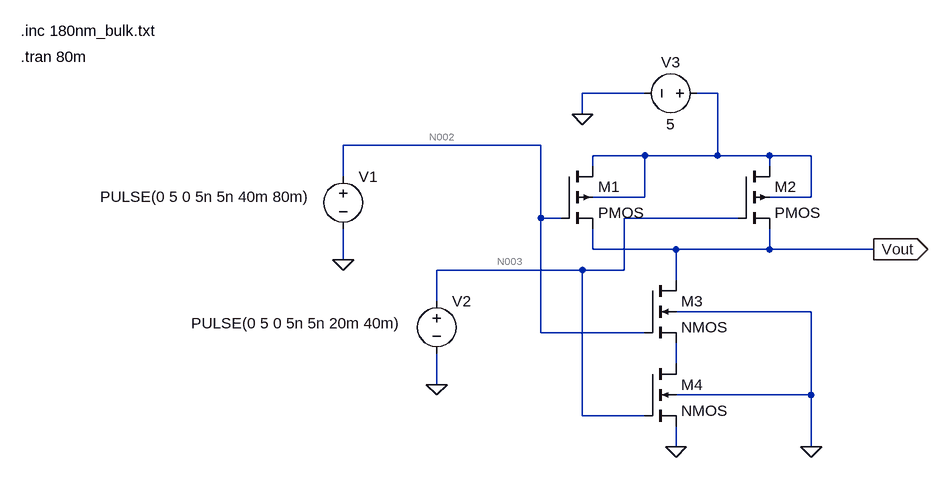
[diagram p0: schematic NAND_Gate2.asc]
NAND_Gate2.asc, the LTspice schematic file:
Version 4
SHEET 1 912 680
WIRE 448 0 352 0
WIRE 560 0 528 0
WIRE 352 32 352 0
WIRE 288 80 -16 80
WIRE 448 96 368 96
WIRE 560 96 560 0
WIRE 560 96 448 96
WIRE 640 96 560 96
WIRE 704 96 640 96
WIRE 368 112 368 96
WIRE 640 112 640 96
WIRE -16 128 -16 80
WIRE 448 160 448 96
WIRE 448 160 368 160
WIRE 704 160 704 96
WIRE 704 160 640 160
WIRE 288 192 288 80
WIRE 320 192 288 192
WIRE 592 192 416 192
WIRE 368 240 368 208
WIRE 496 240 368 240
WIRE 640 240 640 208
WIRE 640 240 496 240
WIRE 800 240 640 240
WIRE -16 256 -16 208
WIRE 352 272 128 272
WIRE 416 272 416 192
WIRE 416 272 352 272
WIRE 496 288 496 240
WIRE 128 320 128 272
WIRE 704 336 496 336
WIRE 288 368 288 192
WIRE 448 368 288 368
WIRE 496 416 496 384
WIRE 128 448 128 400
WIRE 704 464 704 336
WIRE 704 464 496 464
WIRE 352 496 352 272
WIRE 448 496 352 496
WIRE 496 544 496 512
WIRE 704 544 704 464
FLAG -16 256 0
FLAG 128 448 0
FLAG 352 32 0
FLAG 704 544 0
FLAG 496 544 0
FLAG 800 240 Vout
IOPIN 800 240 Out
SYMBOL voltage -16 112 R0
WINDOW 3 -374 47 Left 2
WINDOW 123 0 0 Left 0
WINDOW 39 0 0 Left 0
SYMATTR InstName V1
SYMATTR Value PULSE(0 5 0 5n 5n 40m 80m)
SYMBOL voltage 128 304 R0
WINDOW 3 -378 50 Left 2
WINDOW 123 0 0 Left 0
WINDOW 39 0 0 Left 0
SYMATTR InstName V2
SYMATTR Value PULSE(0 5 0 5n 5n 20m 40m)
SYMBOL voltage 544 0 R90
WINDOW 0 -32 56 VBottom 2
WINDOW 3 32 56 VTop 2
WINDOW 123 0 0 Left 0
WINDOW 39 0 0 Left 0
SYMATTR InstName V3
SYMATTR Value 5
SYMBOL pmos4 320 112 R0
SYMATTR InstName M1
SYMATTR Value2 l=180n w=2u
SYMBOL pmos4 592 112 R0
SYMATTR InstName M2
SYMATTR Value2 l=180n w=2u
SYMBOL nmos4 448 288 R0
SYMATTR InstName M3
SYMATTR Value2 l=180n w=2u
SYMBOL nmos4 448 416 R0
SYMATTR InstName M4
SYMATTR Value2 l=180n w=2u
TEXT -512 -96 Left 2 !.inc 180nm_bulk.txt
TEXT -512 -56 Left 2 !.tran 80m

The netlist it stands for:
* NAND_Gate2.asc
V1 N002 0 PULSE(0 5 0 5n 5n 40m 80m)
V2 N003 0 PULSE(0 5 0 5n 5n 20m 40m)
V3 N001 0 5
M1 N001 N002 Vout N001 PMOS l=180n w=2u
M2 N001 N003 Vout N001 PMOS l=180n w=2u
M3 Vout N002 N004 0 NMOS l=180n w=2u
M4 N004 N003 0 0 NMOS l=180n w=2u
.model NMOS NMOS
.model PMOS PMOS
.lib standard.mos
.inc 180nm_bulk.txt
.tran 80m
.backanno
.end

* Results of the author's LTspice run, read from the files saved beside the schematic
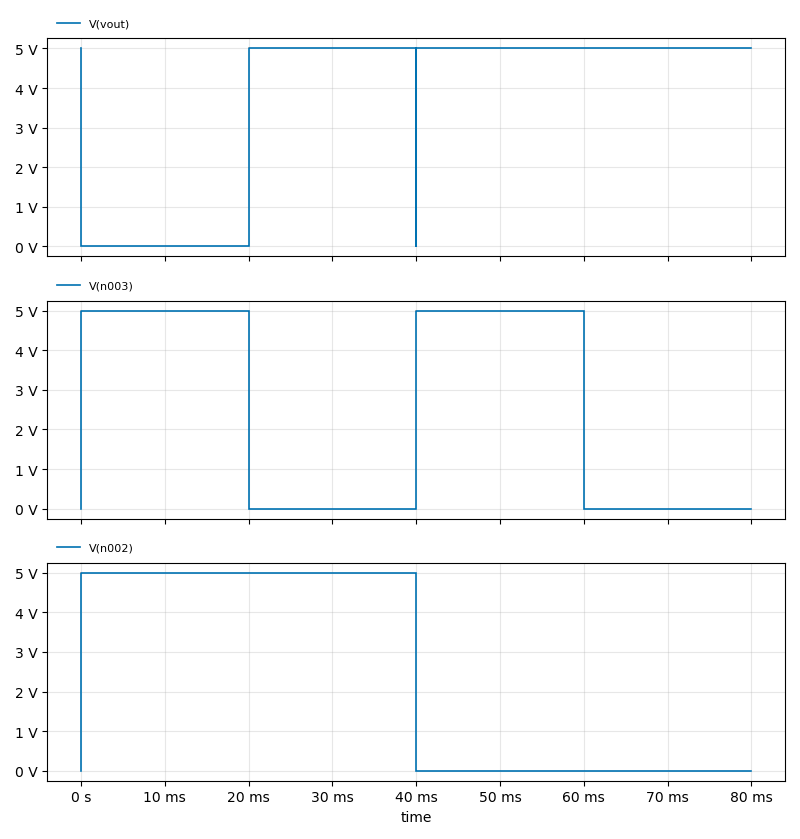
[diagram p1: Transient Analysis of NAND_Gate2.asc, plotted from the saved traces]
* Transient Analysis, 1 run:
*   V(vout): min -3.489 mV, max 5.002 V, average 3.75 V, rms 4.33 V, last 5 V
*   V(n003): min 0 V, max 5 V, average 2.5 V, rms 3.536 V, last 0 V
*   V(n002): min 0 V, max 5 V, average 2.5 V, rms 3.536 V, last 0 V